# EAGLE design Volume_Control (EAGLE 6.3)
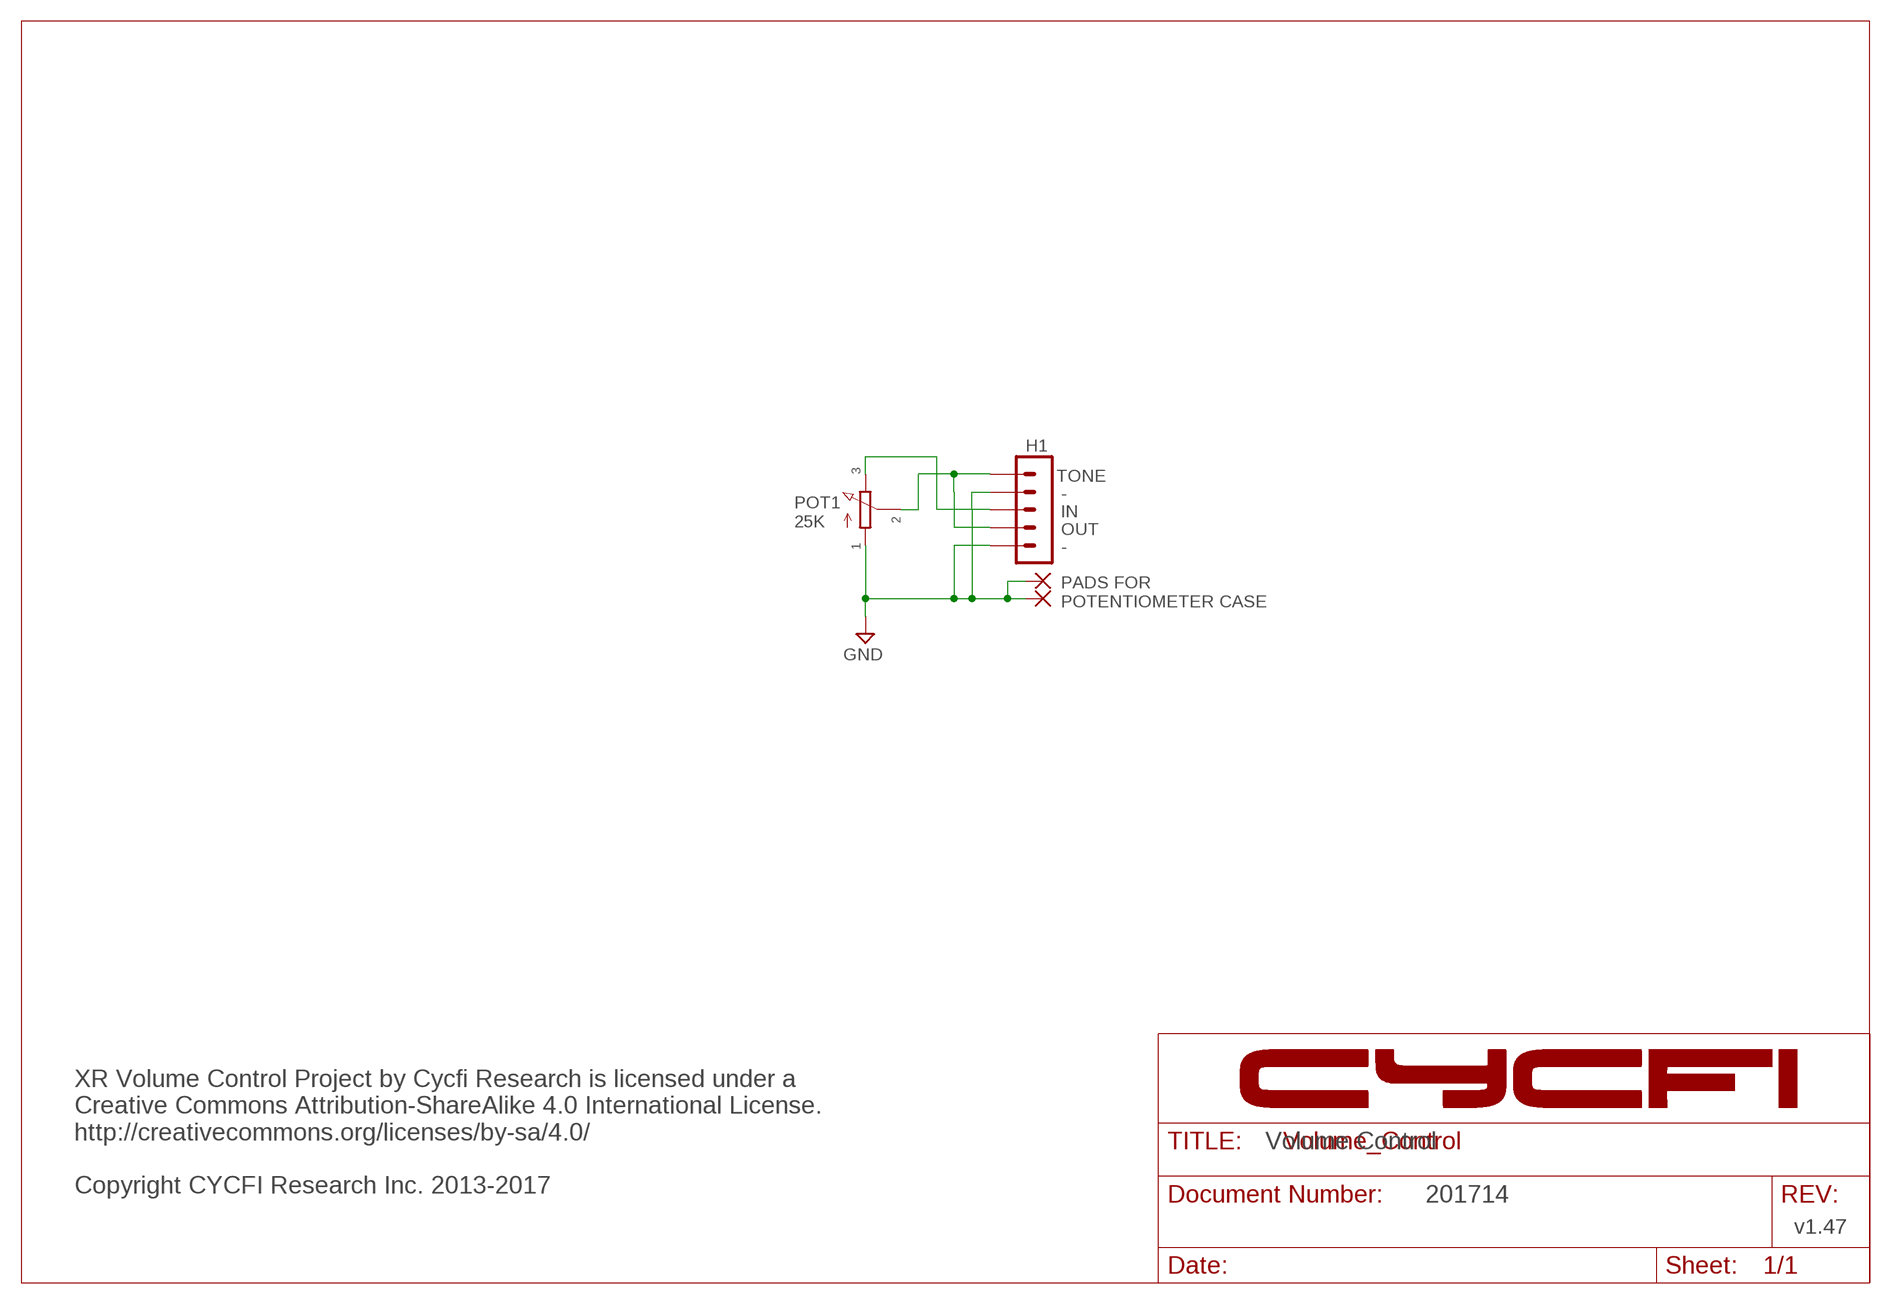
[diagram p0: schematic, sheet 1]

## Parts
GND3  SMD2  [SMD1,27-2,54]
GND4  SMD2  [SMD1,27-2,54]
H1  961105-5500-AR-PR  [5P-SMD-2.54MM]
POT1  PDB241-GTR01  [PDB241]

## Nets
GND: GND3.1(P) GND4.1(P) H1.P$1 H1.P$4 POT1.P$1
N$1: H1.P$3 POT1.P$3
N$3: H1.P$2 H1.P$5 POT1.P$2

## Notes on the sheet
- TONE
- -
- IN
- OUT
- POT1
  25K
- -
- PADS FOR 
  POTENTIOMETER CASE
- Volume Control
- XR Volume Control Project by Cycfi Research is licensed under a
  Creative Commons Attribution-ShareAlike 4.0 International License. 
  http://creativecommons.org/licenses/by-sa/4.0/ 
  
  Copyright CYCFI Research Inc. 2013-2017
- 201714
- v1.47

## Library data of the parts
GND3 GND4 = wirepad:SMD2: SMD PAD
H1 = CYCFI_Con:961105-5500-AR-PR
POT1 = CYCFI_Passive:PDB241-GTR01

## Board
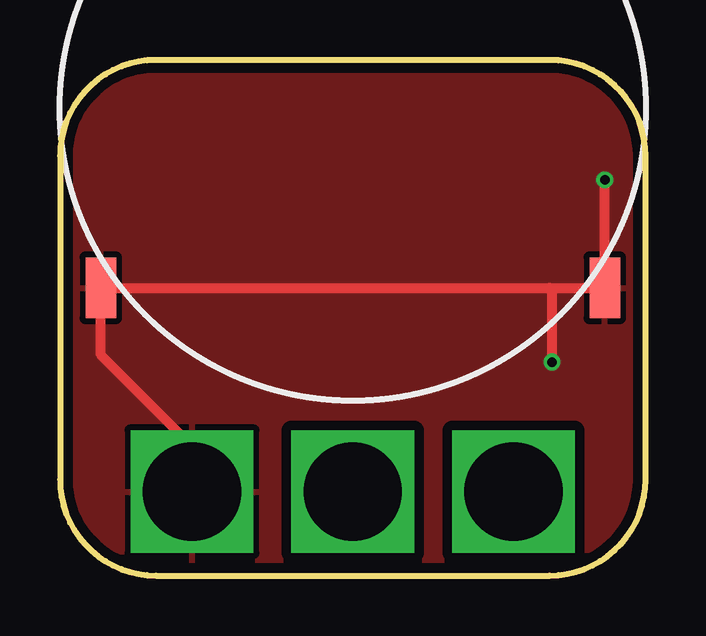
[diagram p1: board, top side]
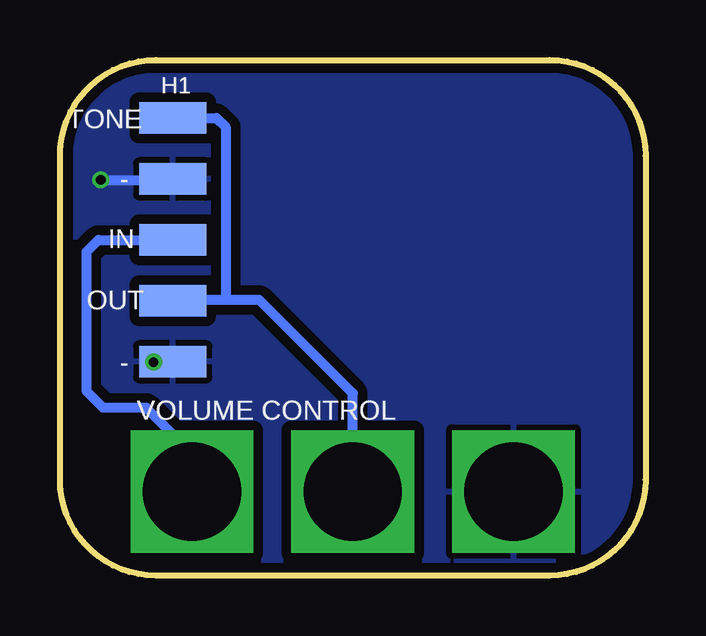
[diagram p2: board, bottom side, seen from below]

Size 24.4 x 21.5 mm. Coordinates in mm from the lower left corner, seen from the top.
Outline: 4,0 20.4,0 arc90 24.4,4 24.4,17.5 arc90 20.4,21.5 4,21.5 arc90 0,17.5 0,4 arc90 4,0
Copper layers (1*16): Top 0.035mm / dielectric 1.5mm / Bottom 0.035mm
Design rules "Fusion_eagle_rule_v1.1": minimum track width 6mil, minimum drill 12mil, track to track 6mil, track to pad 6mil, pad to pad 6mil, via to via 6mil, smd to smd 0mil, copper to edge 10mil, drill to drill 10mil, minimum pad ring 10mil, minimum via ring 6mil, stop-mask expansion 2mil, vias tented up to drill 100mil, thermal gap 10mil

### Footprints (pad centres in the part's own frame; a part is rotated, then mirrored left to right if it is on the bottom)
SMD1,27-2,54 = smd 1.27 x 2.54: 1 0,0
5P-SMD-2.54MM = smd 1.3 x 2.8: P$1 -5.08,0; P$2 -2.54,0; P$3 0,0; P$4 2.54,0; P$5 5.08,0
PDB241 = drill 4.1 square: P$1 -6.7,0; P$2 0,0; P$3 6.7,0

### Placement (x,y rotation side)
GND3  1.7,12 0 top
GND4  22.7,12 0 top
H1  19.7,14 90 bottom
POT1  12.2,3.5 0 top

### Tracks (layer width: path | path; a pad name or v marks a point on that pad's centre or on a via)
GND  (via drill 0.4)
  Top 0.406: POT1.P$1 5.5,5.4 1.7,9.2 GND3.1 20.4,12 | 20.4,12 GND4.1 v22.7,16.5 | v20.5,8.9 20.5,11.9 20.4,12
  Bottom 0.406: v22.7,16.5 20.74,16.5 H1.P$4 | H1.P$1 20.52,8.92 v20.5,8.9
  pour Top (isolate 0.406): 24.4,19.5 24.4,4 arc-90 20.4,0 4,0 arc-90 0,4 0,19.5 arc-90 12.2,31.7 arc-90
  pour Bottom (isolate 0.406): 24.4,19.5 24.4,4 arc-90 20.4,0 4,0 arc-90 0,4 0,19.5 arc-90 12.2,31.7 arc-90
N$1
  Bottom 0.406: POT1.P$3 18.9,5.1 20.8,7 22.6,7 23.3,7.7 23.3,13.5 22.8,14 H1.P$3
N$3
  Bottom 0.406: POT1.P$2 12.2,7.6 16.1,11.5 17.5,11.5 | 17.5,11.5 18.7,11.5 20.66,11.5 H1.P$2 | H1.P$5 19.28,19.08 17.88,19.08 17.5,18.7 17.5,11.5

### Text on the board
bNames: TONE | - | IN | OUT | - | VOLUME CONTROL
_bNames: H1 | TONE | - | IN | OUT | - | VOLUME CONTROL